# EAGLE design Kit 10 Pin Inverter (EAGLE 7.2.0)
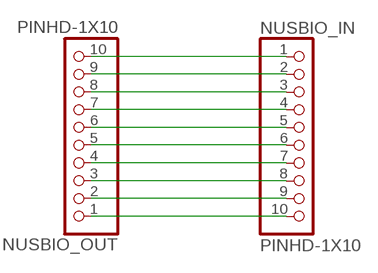
[diagram p0: schematic, sheet 1]

## Parts
NUSBIO_IN  PINHD-1X10  [1X10-BIG]
NUSBIO_OUT  PINHD-1X10  [1X10-BIG]

## Nets
N$1: NUSBIO_IN.1 NUSBIO_OUT.10
N$2: NUSBIO_IN.2 NUSBIO_OUT.9
N$3: NUSBIO_IN.3 NUSBIO_OUT.8
N$4: NUSBIO_IN.4 NUSBIO_OUT.7
N$5: NUSBIO_IN.5 NUSBIO_OUT.6
N$6: NUSBIO_IN.6 NUSBIO_OUT.5
N$7: NUSBIO_IN.7 NUSBIO_OUT.4
N$8: NUSBIO_IN.8 NUSBIO_OUT.3
N$9: NUSBIO_IN.9 NUSBIO_OUT.2
N$10: NUSBIO_IN.10 NUSBIO_OUT.1

## Library data of the parts
NUSBIO_IN NUSBIO_OUT = adafruit:PINHD-1X10: Pin header 1x10 0.1" spacing With round pins

## Board
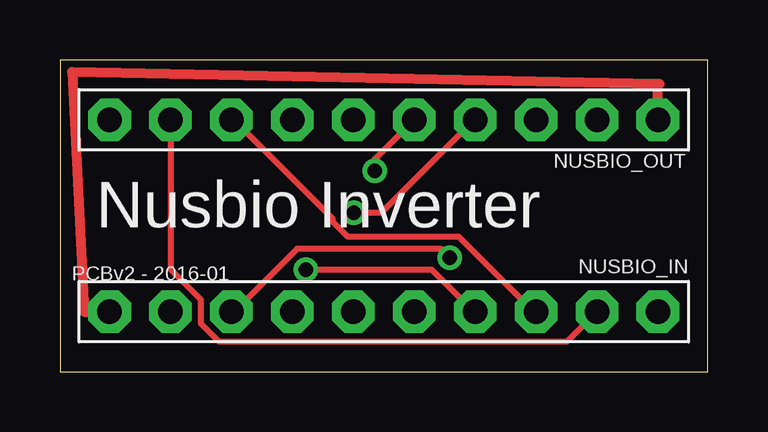
[diagram p1: board, top side]
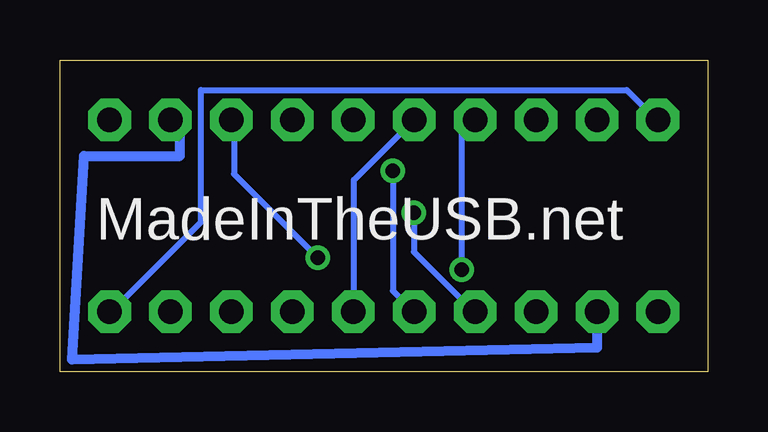
[diagram p2: board, bottom side, seen from below]

Size 27 x 13 mm. Coordinates in mm from the lower left corner, seen from the top.
Outline: 0,0 27,0 27,13 0,13 0,0
Copper layers (1*16): Top 0.035mm / dielectric 1.5mm / Bottom 0.035mm
Design rules "default": minimum track width 10mil, minimum drill 24mil, track to track 8mil, track to pad 8mil, pad to pad 8mil, via to via 8mil, smd to smd 8mil, copper to edge 40mil, drill to drill 8mil, minimum pad ring 10mil, minimum via ring 8mil, stop-mask expansion 4mil, vias tented up to drill 0mil, thermal gap 10mil

### Footprints (pad centres in the part's own frame; a part is rotated, then mirrored left to right if it is on the bottom)
1X10-BIG = drill 1.016 pad 1.778 octagon: 1 -11.43,0; 2 -8.89,0; 3 -6.35,0; 4 -3.81,0; 5 -1.27,0; 6 1.27,0; 7 3.81,0; 8 6.35,0; 9 8.89,0; 10 11.43,0

### Placement (x,y rotation side)
NUSBIO_IN  13.5,2.5 180 top
NUSBIO_OUT  13.5,10.5 180 top

### Tracks (layer width: path | path; a pad name or v marks a point on that pad's centre or on a via)
N$1
  Bottom 0.254: NUSBIO_OUT.10 2.12,10.5 3.38,11.75 21.12,11.75 21.12,6.25 24.88,2.5 NUSBIO_IN.1
N$2
  Top 0.254: NUSBIO_OUT.9 4.62,10.5 4.62,4.25 5.88,3 5.88,2 6.62,1.25 21.12,1.25 22.38,2.5 NUSBIO_IN.2
N$3
  Top 0.254: NUSBIO_OUT.8 7.25,10.5 11.38,6.38 11.38,6.25 12,5.62 16.62,5.62 19.75,2.5 NUSBIO_IN.3
N$4  (via drill 0.61)
  Top 0.254: v10.25,4.25 15.5,4.25 17.25,2.5 NUSBIO_IN.4
  Bottom 0.254: v10.25,4.25 10.25,10 9.75,10.5 NUSBIO_OUT.7
N$5
  Bottom 0.254: NUSBIO_OUT.6 12.25,10.5 14.75,8 14.75,2.5 NUSBIO_IN.5
N$6  (via drill 0.61)
  Top 0.254: v13.12,8.38 13.12,8.88 14.75,10.5 NUSBIO_OUT.5
  Bottom 0.254: v13.12,8.38 13.12,3.38 12.25,2.5 NUSBIO_IN.6
N$7  (via drill 0.61)
  Top 0.254: v12.25,6.62 13.38,6.62 17.25,10.5 NUSBIO_OUT.4
  Bottom 0.254: v12.25,6.62 12.25,5 9.75,2.5 NUSBIO_IN.7
N$8  (via drill 0.61)
  Top 0.254: v16.25,4.75 15.88,5.12 9.88,5.12 7.25,2.5 NUSBIO_IN.8
  Bottom 0.254: v16.25,4.75 19.75,8.25 19.75,10.5 NUSBIO_OUT.3
N$9
  Bottom 0.406: NUSBIO_IN.9 4.61,1 26.5,0.5 26,9 22,9 22,10.5 NUSBIO_OUT.2
N$10
  Top 0.406: NUSBIO_OUT.1 24.93,12 | 24.93,12 25,12 | 24.93,12 0.5,12.5 1,2.5 NUSBIO_IN.10

### Text on the board
tNames: Nusbio Inverter | PCBv2 - 2016-01
bNames: MadeInTheUSB.net